# EAGLE design controller (EAGLE 7.4.0)
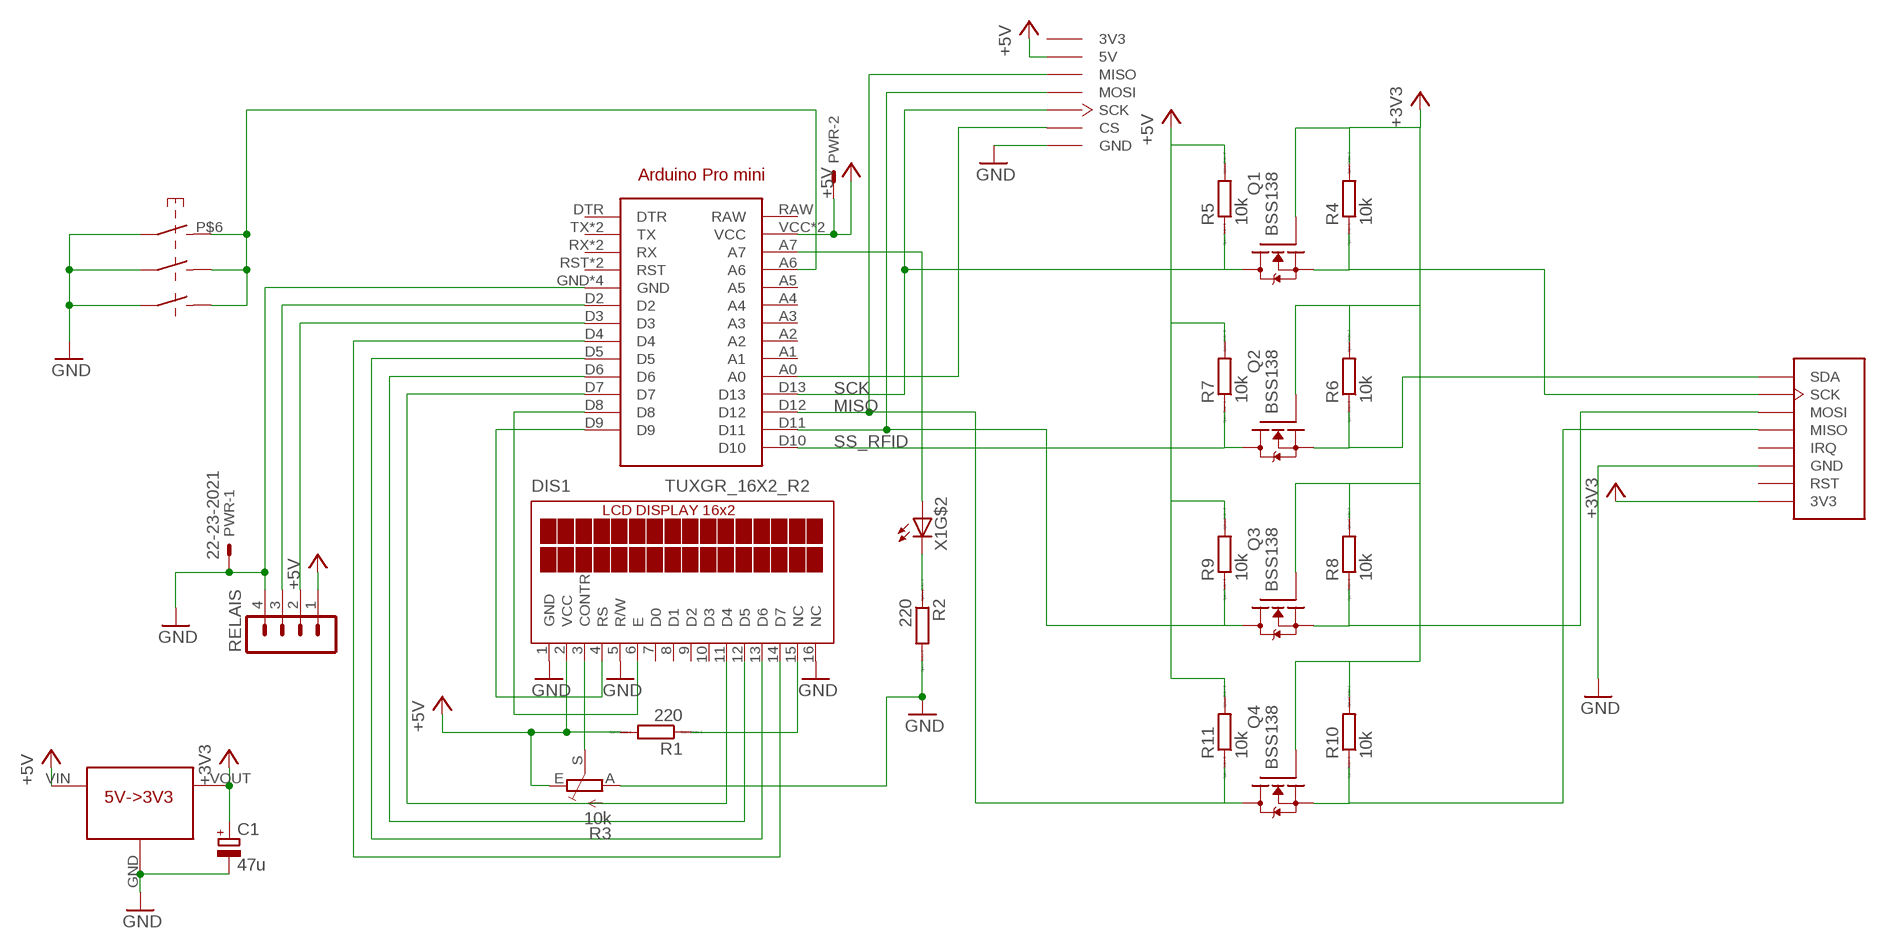
[diagram p0: schematic, sheet 1]

## Parts
ARDUINO1  ARDUINO_PRO_MINI  [ARDUINO_PRO_MINI]
C1  47u  CPOL-EUB45181B  [B45181B]
DIS1  TUXGR_16X2_R2  [TUXGR_16X2_R2]
PWR  22-23-2021  [22-23-2021]
Q1  BSS138  [SOT23]
Q2  BSS138  [SOT23]
Q3  BSS138  [SOT23]
Q4  BSS138  [SOT23]
R1  220  R  [R0805]
R2  220  R  [R0805]
R3  10k  TRIM_EU-CA9V  [CA9V]
R4  10k  R  [R0805]
R5  10k  R  [R0805]
R6  10k  R  [R0805]
R7  10k  R  [R0805]
R8  10k  R  [R0805]
R9  10k  R  [R0805]
R10  10k  R  [R0805]
R11  10k  R  [R0805]
RELAIS  MA04-1  [MA04-1]
U$1  SD_CARD  [SD_CARD]
U$3  RFID-RC522  [BOARD]
U$4  PWR_CONV  [PWR_CONV]
X1  PUSHBUTTON_LED  [PUSHBUTTON_LED]

## Nets
+3V3: C1.+ Q1.1(G) Q2.1(G) Q3.1(G) Q4.1(G) R4.2 R6.2 R8.2 R10.2 U$3.3V3 U$4.VOUT
+5V: ARDUINO1.VCC ARDUINO1.VCC@1(VCC) DIS1.2(VCC) PWR.2 R1.2 R3.E R5.2 R7.2 R9.2 R11.2 RELAIS.1 U$1.P$5V(5V) U$1.P$5V_2(5V) U$4.VIN
GND: ARDUINO1.GND ARDUINO1.GND@1(GND) ARDUINO1.GND@2(GND) ARDUINO1.GND@3(GND) C1.- DIS1.1(GND) DIS1.5(R/W) DIS1.16(NC) PWR.1 R2.2 R3.A RELAIS.4 U$1.GND U$1.GND$2(GND) U$1.GND$3(GND) U$1.GND$4(GND) U$3.GND U$4.GND X1.P$1 X1.P$3 X1.P$5
MISO: ARDUINO1.D12 Q4.3(D) R11.1 U$1.P$MISO2(MISO) U$1.P$MISO(MISO)
MOSI: ARDUINO1.D11 Q3.3(D) R9.1 U$1.P$MOSI2(MOSI) U$1.P$MOSI(MOSI)
N$1: R2.1 X1.P$C(C)
N$2: Q1.2(S) R4.1 U$3.SCK
N$3: Q3.2(S) R8.1 U$3.MOSI
N$4: Q4.2(S) R10.1 U$3.MISO
N$5: ARDUINO1.A0 U$1.P$CS2(CS) U$1.P$CS(CS)
N$7: ARDUINO1.D5 DIS1.13(D6)
N$8: DIS1.3(CONTR) R3.S
N$10: ARDUINO1.D7 DIS1.11(D4)
N$11: ARDUINO1.A7 X1.P$A(A)
N$12: ARDUINO1.D8 DIS1.6(E)
N$13: ARDUINO1.D9 DIS1.4(RS)
N$14: ARDUINO1.D6 DIS1.12(D5)
N$15: ARDUINO1.D3 RELAIS.2
N$16: ARDUINO1.D2 RELAIS.3
N$17: ARDUINO1.A6 X1.P$2 X1.P$4 X1.P$6
N$18: DIS1.15(NC) R1.1
N$19: ARDUINO1.D4 DIS1.14(D7)
SCK: ARDUINO1.D13 Q1.3(D) R5.1 U$1.P$SCK2(SCK) U$1.P$SCK(SCK)
SS_RFID: ARDUINO1.D10 Q2.3(D) R7.1
SS_RFID_3V3: Q2.2(S) R6.1 U$3.SDA
Unconnected: ARDUINO1.A1 ARDUINO1.A2 ARDUINO1.A3 ARDUINO1.A4 ARDUINO1.A5 ARDUINO1.DTR ARDUINO1.RAW ARDUINO1.RST ARDUINO1.RST@1(RST) ARDUINO1.RX ARDUINO1.RX@1(RX) ARDUINO1.TX ARDUINO1.TX@1(TX) DIS1.7(D0) DIS1.8(D1) DIS1.9(D2) DIS1.10(D3) U$3.IRQ U$3.RST

## Power pins joined to a net without a drawn wire
3V3: U$1.P$3V3(3V3) U$1.P$3V3_2(3V3)

## Library data of the parts
ARDUINO1 = arduinopromini:ARDUINO_PRO_MINI: For creating Arduino Pro Mini shields
C1 = rcl:CPOL-EU: POLARIZED CAPACITOR, European symbol
DIS1 = display-lcd:TUXGR_16X2_R2: Tuxgraphics LCD display 16x2 characters reflective, without background light Source: tuxgr_12x2_r2.pdf; OC_FARNELL: unknown; OC_NEWARK: unknown
PWR = con-molex:22-23-2021: .100" (2.54mm) Center Header - 2 Pin; MF: MOLEX; MPN: 22-23-2021; OC_FARNELL: 1462926; OC_NEWARK: 25C3832
Q1-Q4 = local:BSS138: BSS138 N-Channel FET 50V, 0.22A
R1 R2 R4-R11 = eagle-ltspice:R: RESISTOR, European symbol; SPICEMODEL: NONE; SPICEPREFIX: R
R3 = pot:TRIM_EU-: POTENTIOMETER
RELAIS = con-lstb:MA04-1: PIN HEADER; OC_FARNELL: unknown; OC_NEWARK: unknown
U$1 = local:SD_CARD
U$3 = local:RFID-RC522: RFID-Interface based on RC522
U$4 = local:PWR_CONV
X1 = local:PUSHBUTTON_LED: Pushbutton with indicator LED

## Net classes
0 default: width 0.406 mm, clearance 0.254 mm

## Board
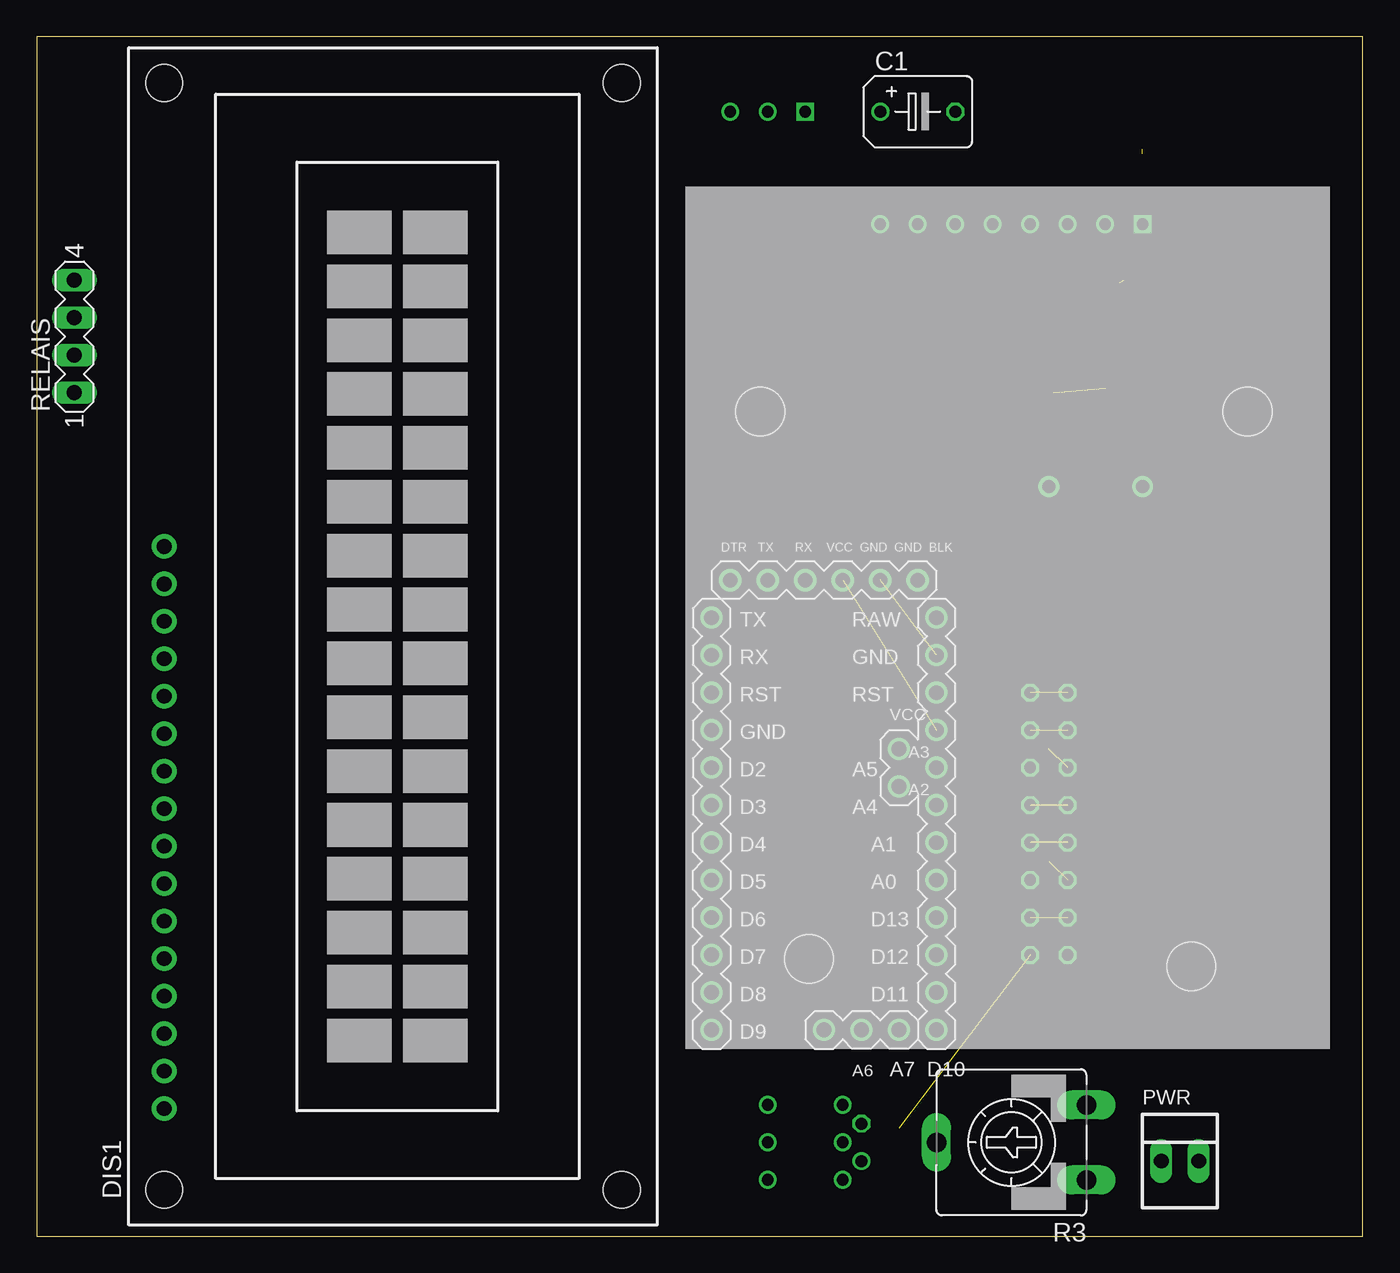
[diagram p1: board, top side]
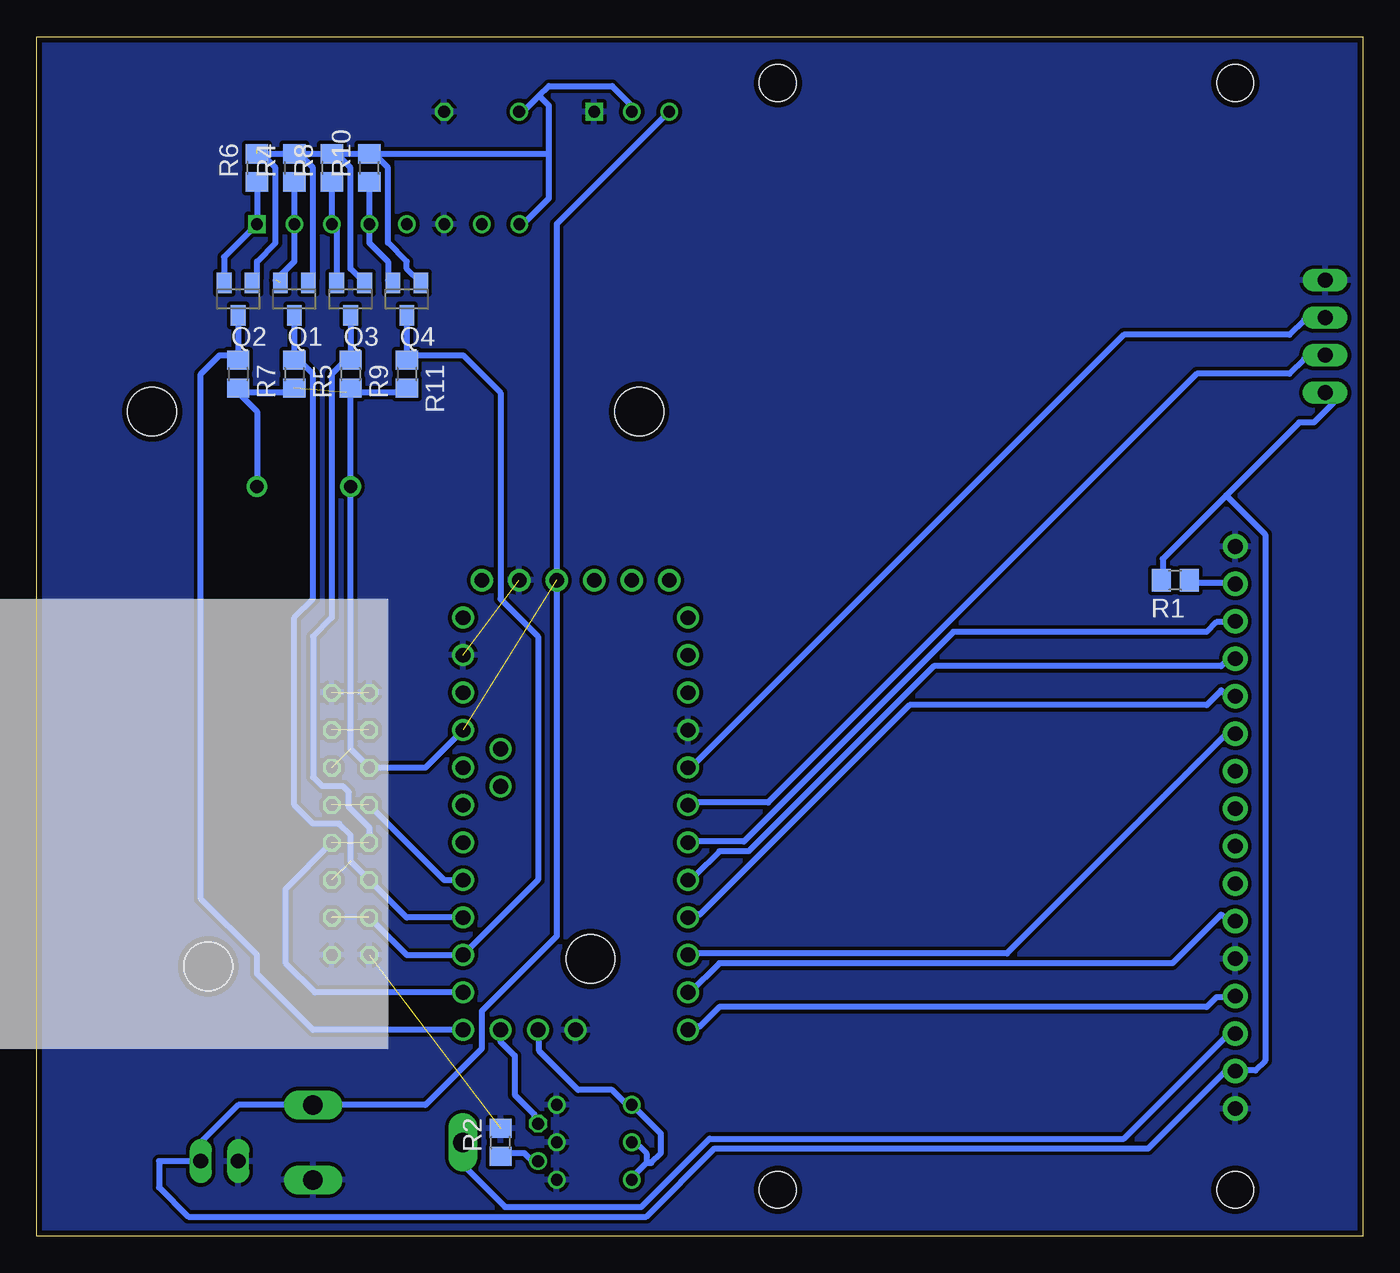
[diagram p2: board, bottom side, seen from below]

Size 89.84 x 81.27 mm. Coordinates in mm from the lower left corner, seen from the top.
Outline: 0,0 89.84,0 89.84,81.27 0,81.27 0,0
Copper layers (1*16): Top 0.0356mm / dielectric 1.5011mm / Bottom 0.0356mm
Design rules "LaenPCBOrder": minimum track width 6mil, minimum drill 13mil, track to track 6mil, track to pad 6mil, pad to pad 6mil, via to via 6mil, smd to smd 6mil, copper to edge 15mil, drill to drill 6mil, minimum pad ring 7mil, minimum via ring 7mil, stop-mask expansion 3mil, vias tented up to drill 0mil, thermal gap 10mil

### Footprints (pad centres in the part's own frame; a part is rotated, then mirrored left to right if it is on the bottom)
ARDUINO_PRO_MINI = drill 1: A0 11.43,-8.89; A1 11.43,-6.35; A2 11.43,-3.81; A3 11.43,-1.27; A4 8.89,-2.54; A5 8.89,0; A6 6.35,-19.05; A7 8.89,-19.05; BLK 10.16,11.43; D2 -3.81,-1.27; D3 -3.81,-3.81; D4 -3.81,-6.35; D5 -3.81,-8.89; D6 -3.81,-11.43; D7 -3.81,-13.97; D8 -3.81,-16.51; D9 -3.81,-19.05; D10 11.43,-19.05; D11 11.43,-16.51; D12 11.43,-13.97; D13 11.43,-11.43; DTR -2.54,11.43; GND -3.81,1.27; GND@1 11.43,6.35; GND@2 7.62,11.43; GND@3 3.81,-19.05; RAW 11.43,8.89; RST 11.43,3.81; RST@1 -3.81,3.81; RX -3.81,6.35; RX@1 2.54,11.43; TX -3.81,8.89; TX@1 0,11.43; VCC 11.43,1.27; VCC@1 5.08,11.43
B45181B = drill 0.813: + -2.54,0 | drill 0.813 octagon: - 2.54,0
TUXGR_16X2_R2 = drill 1 pad 1.676: 1 -32,15.5; 2 -29.46,15.5; 3 -26.92,15.5; 4 -24.38,15.5; 5 -21.84,15.5; 6 -19.3,15.5; 7 -16.76,15.5; 8 -14.22,15.5; 9 -11.68,15.5; 10 -9.14,15.5; 11 -6.6,15.5; 12 -4.06,15.5; 13 -1.52,15.5; 14 1.02,15.5; 15 3.56,15.5; 16 6.1,15.5 | hole 2.5: -37.5,-15.5; 37.5,-15.5; -37.5,15.5; 37.5,15.5
22-23-2021 = drill 1 long: 1 -1.27,0; 2 1.27,0
SOT23 = smd 1 x 1.4: 1 -0.95,-1.1; 2 0.95,-1.1; 3 0,1.1
R0805 = smd 1.3 x 1.5: 1 -0.95,0; 2 0.95,0
CA9V = drill 1.321 long: A -2.54,-5.08; E 2.54,-5.08; S 0,5.08
MA04-1 = drill 1.016 long: 1 -3.81,0; 2 -1.27,0; 3 1.27,0; 4 3.81,0
SD_CARD = drill 0.8 octagon: GND -1.27,8.89; GND$2 1.27,8.89; GND$3 -1.27,-8.89; GND$4 1.27,-8.89; P$3V3 -1.27,-6.35; P$3V3_2 1.27,-6.35; P$5V -1.27,-3.81; P$5V_2 1.27,-3.81; P$CS -1.27,-1.27; P$CS2 1.27,-1.27; P$MISO -1.27,6.35; P$MISO2 1.27,6.35; P$MOSI -1.27,1.27; P$MOSI2 1.27,1.27; P$SCK -1.27,3.81; P$SCK2 1.27,3.81
BOARD = drill 0.8: 3V3 30.48,2.54; GND 25.4,2.54; IRQ 22.86,2.54; MISO 20.32,2.54; MOSI 17.78,2.54; RST 27.94,2.54; SCK 15.24,2.54 | drill 0.8 square: SDA 12.7,2.54 | hole 3.302: 5.588,15.24; 38.608,15.24; 9.398,52.832; 35.306,52.324
PWR_CONV = drill 0.8 square: GND 2.54,0 | drill 0.8: VIN -2.54,0; VOUT 0,0
PUSHBUTTON_LED = drill 0.8: P$1 -2.54,2.54; P$2 2.54,2.54; P$3 -2.54,0; P$4 2.54,0; P$5 -2.54,-2.54; P$6 2.54,-2.54; P$C -3.81,1.27 | drill 0.8 octagon: P$A -3.81,-1.27

### Placement (x,y rotation side)
ARDUINO1  49.53,33.02 0 top
C1  59.69,76.2 0 top
DIS1  24.13,40.64 90 top
PWR  77.47,5.08 0 top
Q1  72.39,63.5 180 bottom
Q2  76.2,63.5 180 bottom
Q3  68.58,63.5 180 bottom
Q4  64.77,63.5 180 bottom
R1  12.7,44.45 180 bottom
R2  58.42,6.35 90 bottom
R3  66.04,6.35 90 top
R4  72.39,72.39 90 bottom
R5  72.39,58.42 270 bottom
R6  74.93,72.39 90 bottom
R7  76.2,58.42 270 bottom
R8  69.85,72.39 90 bottom
R9  68.58,58.42 270 bottom
R10  67.31,72.39 90 bottom
R11  64.77,58.42 270 bottom
RELAIS  2.54,60.96 90 top
U$1  68.58,27.94 180 bottom
U$3  87.63,71.12 180 top
U$4  49.53,76.2 0 top
X1  52.07,6.35 180 top

### Tracks (layer width: path | path; a pad name or v marks a point on that pad's centre or on a via)
3V3  (1 unrouted)
+3V3  (1 unrouted)
  Bottom 0.406: U$4.VOUT 49.53,76.61 50.85,77.93 55.14,77.93 55.8,77.27 | 55.8,77.27 57.12,75.95 C1.+ | 56.79,68.68 57.12,68.68 U$3.3V3 56.79,68.68 | 55.8,77.27 55.14,76.61 55.14,73.34 | 55.14,73.34 55.14,70.33 56.79,68.68 | R6.2 R4.2 | R4.2 R8.2 | R8.2 R10.2 | R10.2 55.14,73.34 | Q3.1 68.58,65.55 68.58,72.39 69.53,73.34 R8.2 | Q1.1 71.12,64.92 71.12,72.39 72.07,73.34 R4.2 | Q2.1 74.93,64.92 74.93,66.04 73.66,67.31 73.66,72.39 74.93,73.66 | Q4.1 64.77,65.55 64.77,66.04 66.04,67.31 66.04,72.39 66.99,73.34 R10.2
+5V  (via drill 0.9 pad 1.42)  (3 unrouted)
  Bottom 0.406: 9.25,50.19 4.29,55.14 3.3,55.14 1.98,56.46 1.98,56.79 2.31,57.12 RELAIS.1 | 9.25,50.19 13.54,45.9 13.54,44.58 R1.2 | 9.25,50.19 6.6,47.55 6.6,11.89 7.26,11.23 8.59,11.23 DIS1.2 8.91,11.23 9.25,11.23 14.53,5.94 43.92,5.94 48.54,1.32 79.58,1.32 81.56,3.3 81.56,5.08 PWR.2 78.74,6.35 76.2,8.89 R3.E 63.5,8.89 59.69,12.7 59.69,15.24 54.61,20.32 ARDUINO1.VCC@1 | 54.48,44.58 ARDUINO1.VCC@1 | 47.22,75.95 U$4.VIN 54.61,68.58 ARDUINO1.VCC@1 | ARDUINO1.VCC 63.5,31.75 U$1.P$5V 68.58,33.02 v68.58,50.8 R9.2 | 64.45,57.15 R11.2 65.09,57.15 68.58,57.15 R9.2 | R9.2 68.9,57.15 | 76.2,57.15 72.39,57.15 R5.2 | R7.2 76.2,57.15 | 76.2,57.15 74.93,55.88 v74.93,50.8
GND  (3 unrouted)
  Bottom 0.406: U$1.GND$2 70,19.15 69.85,19.15
  pour Bottom: 0,81.28 90.17,81.28 90.17,0 0,0
MISO  (1 unrouted)
  Bottom 0.406: Q4.3 64.77,59.69 | R11.1 64.77,59.69 | 64.77,59.69 60.96,59.69 58.42,57.15 58.42,43.18 55.88,40.64 55.88,24.13 ARDUINO1.D12 64.77,19.05 U$1.P$MISO
MOSI  (1 unrouted)
  Bottom 0.406: ARDUINO1.D11 70.99,16.51 72.97,18.49 72.97,23.55 U$1.P$MOSI2 | Q3.3 68.58,59.69 | 68.58,59.69 R9.1 | 68.58,59.69 69.85,58.42 69.85,41.91 71.12,40.64 71.12,31.11 70.48,30.48 69.09,30.48 68.71,30.1 68.71,29.08 67.31,27.69 U$1.P$MOSI
N$1
  Bottom 0.406: R2.1 58.12,5.61 56.79,5.61 56.13,4.95 X1.P$C
N$2  (1 unrouted)
  Bottom 0.406: R4.1 U$3.SCK 72.39,66.04 73.66,64.77
N$3
  Bottom 0.406: R8.1 U$3.MOSI 69.53,68.26 Q3.2
N$4
  Bottom 0.406: R10.1 U$3.MISO 67.31,67.31 66.04,66.04 66.04,64.77 65.87,64.6 Q4.2
N$5  (1 unrouted)
  Bottom 0.406: U$1.P$CS 62.23,24.13 ARDUINO1.A0
N$7
  Bottom 0.406: ARDUINO1.D5 45.57,24.43 45.24,24.43 43.59,26.09 41.6,26.09 29.06,38.63 9.58,38.63 8.91,39.29 DIS1.13
N$8
  Bottom 0.406: DIS1.3 8.91,13.54 9.25,13.54 16.18,6.6 44.25,6.6 48.87,1.98 58.12,1.98 60.76,4.62 60.76,6.27 R3.S
N$10
  Bottom 0.406: ARDUINO1.D7 45.57,19.15 24.11,19.15 8.91,34.34 DIS1.11
N$11
  Bottom 0.406: X1.P$A 56.13,7.92 56.13,8.26 57.45,9.58 57.45,12.22 58.45,13.21 58.45,13.87 ARDUINO1.A7
N$12
  Bottom 0.406: ARDUINO1.D8 45.57,16.51 43.59,18.49 12.88,18.49 9.58,21.79 8.91,21.13 DIS1.6
N$13
  Bottom 0.406: ARDUINO1.D9 45.57,14.2 44.91,14.2 43.59,15.52 10.57,15.52 9.91,16.18 8.91,16.18 DIS1.4
N$14
  Bottom 0.406: ARDUINO1.D6 45.57,21.79 44.91,21.79 30.71,35.99 10.57,35.99 9.58,36.98 8.91,36.32 DIS1.12
N$15
  Bottom 0.406: ARDUINO1.D3 45.57,29.39 40.28,29.39 11.23,58.45 4.95,58.45 3.96,59.44 2.64,59.44 RELAIS.2
N$16
  Bottom 0.406: ARDUINO1.D2 45.57,32.03 45.24,32.03 16.18,61.09 4.95,61.09 3.96,62.08 2.64,62.08 RELAIS.3
N$17
  Bottom 0.406: 48.54,4.95 49.53,3.96 X1.P$2 | 48.54,4.95 48.54,5.61 49.53,6.6 X1.P$4 | 49.53,8.59 49.2,8.59 47.55,6.93 47.55,5.61 48.21,4.95 48.54,4.95 | 49.53,8.59 50.85,9.91 53.16,9.91 55.8,12.55 55.8,13.87 ARDUINO1.A6 | 49.53,8.59 X1.P$6
N$18
  Bottom 0.406: R1.1 11.56,44.25 8.91,44.25 DIS1.15
N$19
  Bottom 0.406: ARDUINO1.D4 45.57,26.75 41.94,26.75 27.74,40.95 10.57,40.95 9.91,41.6 8.91,41.6 DIS1.14
SCK  (1 unrouted)
  Bottom 0.406: Q1.3 R5.1 72.07,59.37 71.12,58.42 71.12,43.18 72.39,41.91 72.39,29.21 71.12,27.94 69.34,27.94 68.58,27.18 68.58,25.4 U$1.P$SCK 64.77,21.59 ARDUINO1.D13
SS_RFID
  Bottom 0.406: Q2.3 R7.1 76.52,59.69 77.47,59.69 78.74,58.42 78.74,22.86 74.93,19.05 74.93,17.78 71.12,13.97 ARDUINO1.D10
SS_RFID_3V3
  Bottom 0.406: R6.1 U$3.SDA 77.15,66.36 Q2.2